# EAGLE design untitled (EAGLE 7.2.0)
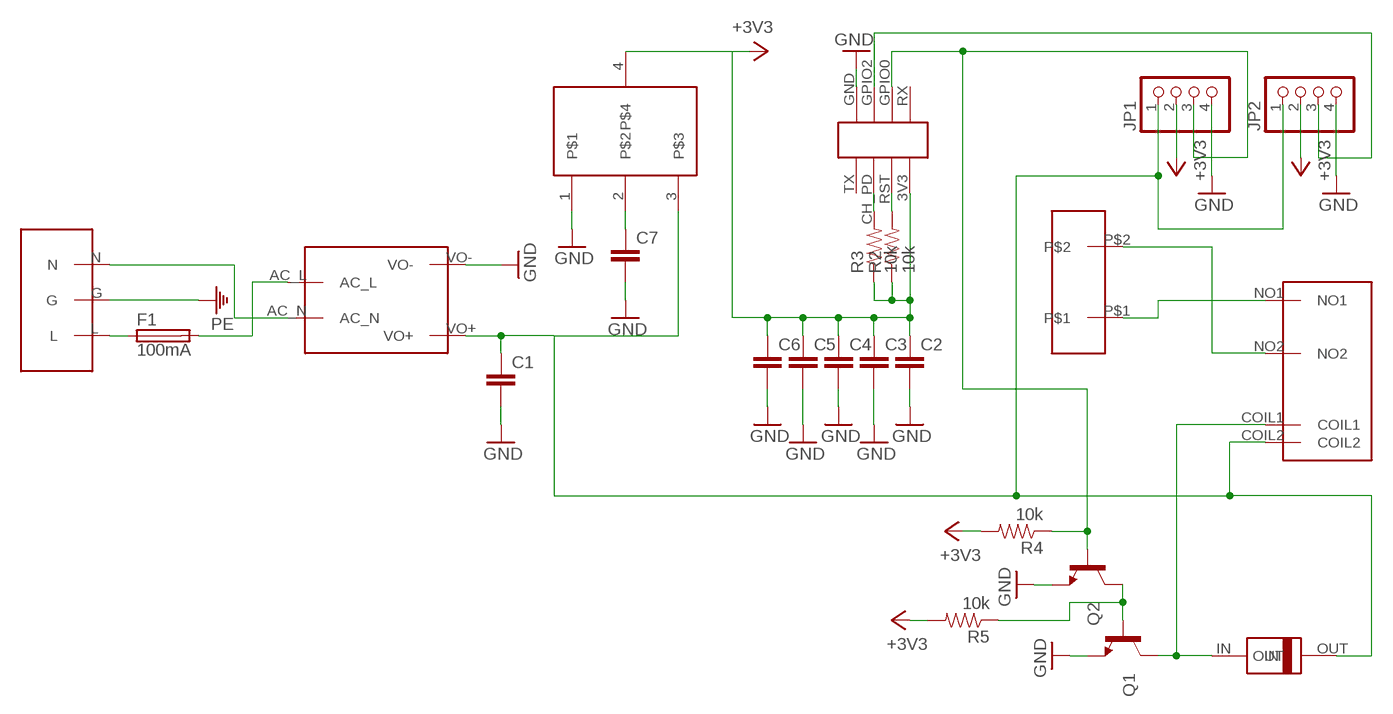
[diagram p0: schematic, sheet 1]

## Parts
C1  CAP0805  [0805]
C2  CAP0805  [0805]
C3  CAP0805  [0805]
C4  CAP0805  [0805]
C5  CAP0805  [0805]
C6  CAP0805  [0805]
C7  CAP0805  [0805]
DIODE1  DIODE_1N4148WQ-7-F  [DIODE_1N4148WQ-7-F]
F1  100mA  SH22,5A  [SH22,5A]
JP1  PINHD-1X4  [1X04]
JP2  PINHD-1X4  [1X04]
Q1  TRANSISTOR_NPNSOT23  [SOT23]
Q2  TRANSISTOR_NPNSOT23  [SOT23]
R2  10k  220-5%  [0603-RES]
R3  10k  220-5%  [0603-RES]
R4  10k  220-5%  [0603-RES]
R5  10k  220-5%  [0603-RES]
U$1  MAINS_CONVERTERS  [HLK-PM01]
U$2  SCREWTERMINALS_5MM  [3PIN_LNG]
U$4  VREG  [SOT223]
U$5  SCREWTERMINALS_5MM_2  [TERMINAL_2X]
U$6  OMRON_G6M-1A  [OMRON_G6M-1A]
U$7  ESP8266-01  [ESP8266-01]

## Nets
+3V3 [low voltage]: C2.1 C3.1 C4.1 C5.1 C6.1 JP1.2 JP2.2 R2.1 R3.1 R4.2 R5.2 U$4.4 U$7.3V3
GND [low voltage]: C1.2 C2.2 C3.2 C4.2 C5.2 C6.2 C7.2 JP1.4 JP2.4 Q1.2(E) Q2.2(E) U$1.VO- U$4.1 U$7.GND
N$1: F1.2 U$1.AC_L
N$2: U$1.AC_N U$2.N
N$3: F1.1 U$2.L
N$4 [low voltage]: C1.1 DIODE1.OUT JP1.1 JP2.1 U$1.VO+ U$4.3 U$6.COIL2
N$5 [low voltage]: Q1.1(B) Q2.3(C) R5.1
N$6: U$5.P$2 U$6.NO2
N$7: U$5.P$1 U$6.NO1
N$8 [low voltage]: DIODE1.IN Q1.3(C) U$6.COIL1
N$9 [low voltage]: JP2.3 U$7.GPIO2
N$11 [low voltage]: R2.2 U$7.RST
N$12 [low voltage]: C7.1 U$4.2
N$13 [low voltage]: JP1.3 Q2.1(B) R4.1 U$7.GPIO0
N$14 [low voltage]: R3.2 U$7.CH_PD
PE: U$2.G
Unconnected: U$7.RX U$7.TX

## Library data of the parts
C1-C7 = SparkFun-Capacitors:CAP: Capacitor Standard 0603 ceramic capacitor, and 0.1" leaded capacitor.
DIODE1 = captain-slow:DIODE_1N4148WQ-7-F
F1 = fuse:SH22,5A: FUSE HOLDER grid 22,5mm, isolated cap OGN0031 8201, Schurter (Buerklin); MPN: 0031.7701.11; OC_FARNELL: unknown; OC_NEWARK: 04F1224
JP1 JP2 = pinhead:PINHD-1X4: PIN HEADER
Q1 Q2 = SparkFun:TRANSISTOR_NPN: Transistor NPN BJT configuration in SOT23 package. MMBT2222 is the common NPN we use. Double check BCE configuration again layout.
R2-R5 = SparkFun-Resistors:220-5%: 220-ohm SMT 1/8W - 5% (0805) RES-07866; PROD_ID: RES-07866; VALUE: 220
U$1 = captain-slow:MAINS_CONVERTERS
U$2 = captain-slow:SCREWTERMINALS_5MM
U$4 = 4pi:VREG
U$5 = captain-slow:SCREWTERMINALS_5MM_2
U$6 = captain-slow:OMRON_G6M-1A
U$7 = captain-slow:ESP8266-01

## Net classes
0 mains: width 0.203 mm, clearance 1.25 mm
1 low voltage: width 0.203 mm, drill 0.127 mm, clearance 0.305 mm to class 0, clearance 0.305 mm

## Board
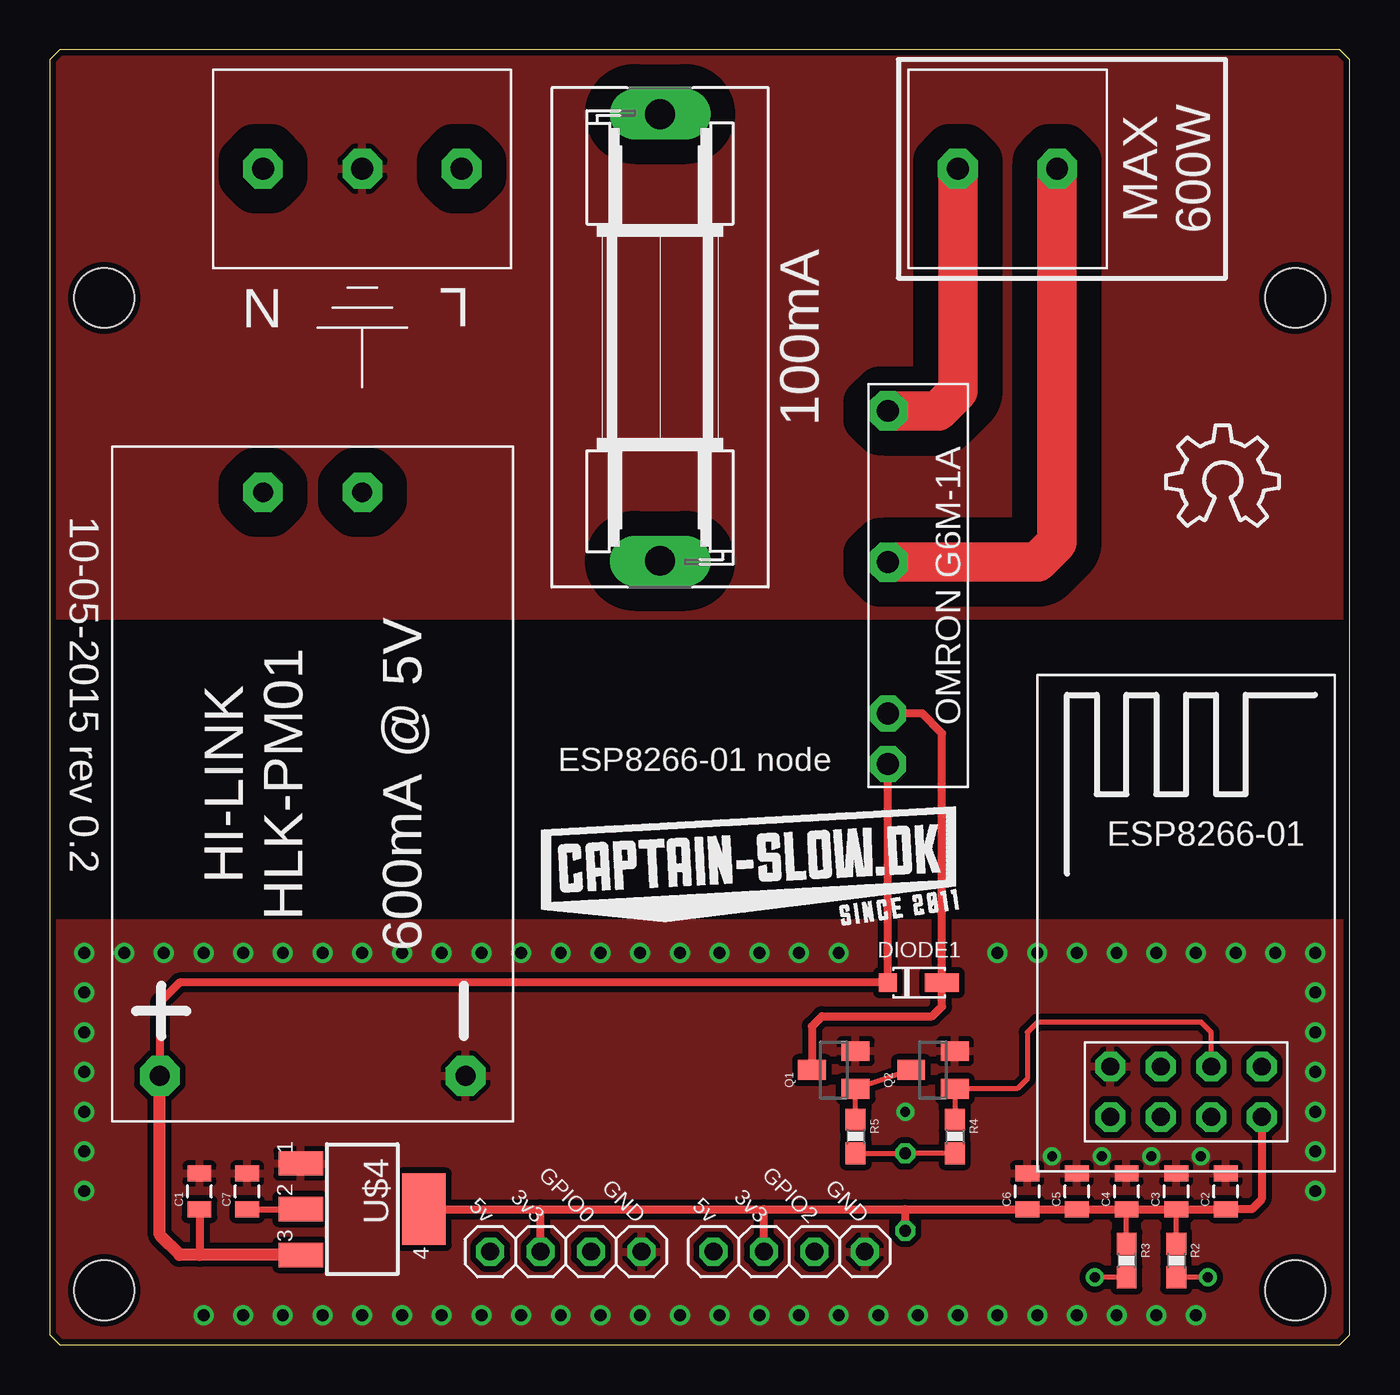
[diagram p1: board, top side]
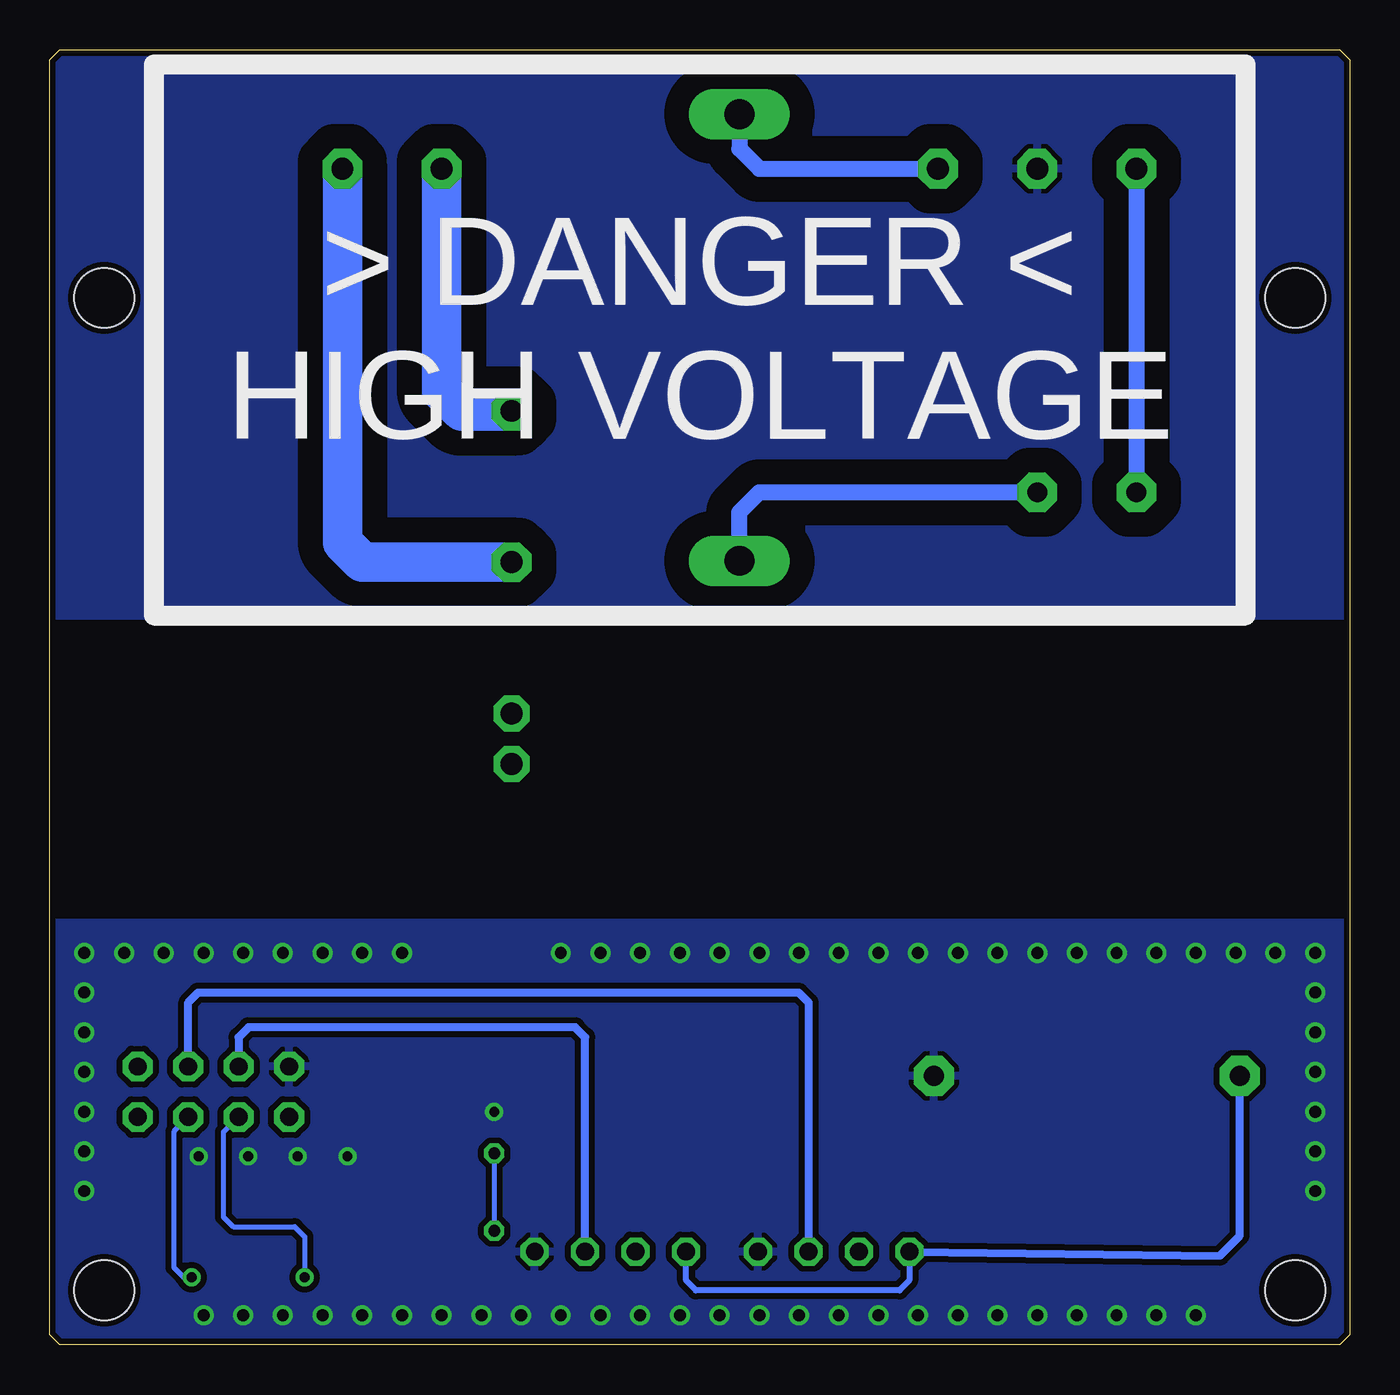
[diagram p2: board, bottom side, seen from below]

Size 65.5 x 65.25 mm. Coordinates in mm from the lower left corner, seen from the top.
Outline: 65,65.25 0.5,65.25 0,64.75 0,0.5 0.5,0 65,0 65.5,0.5 65.5,64.75 65,65.25
Copper layers (1*16): Top 0.035mm / dielectric 1.5mm / Bottom 0.035mm
Design rules "default *": minimum track width 10mil, minimum drill 24mil, track to track 8mil, track to pad 8mil, pad to pad 8mil, via to via 8mil, smd to smd 8mil, copper to edge 12mil, drill to drill 8mil, minimum pad ring 10mil, minimum via ring 8mil, stop-mask expansion 4mil, vias tented up to drill 0.7mm, thermal gap 10mil
Holes 3 mm at 2.75,2.75 62.75,2.75 2.75,52.75 62.75,52.75

### Footprints (pad centres in the part's own frame; a part is rotated, then mirrored left to right if it is on the bottom)
0805 = smd 0.8 x 1.2: 1 -0.9,0; 2 0.9,0
DIODE_1N4148WQ-7-F = smd 1.7 x 0.95: IN 1.15,0 | smd 0.9 x 0.95: OUT -1.575,0
SH22,5A = drill 1.5 pad 2.54 long: 1 -11.252,0; 2 11.252,0
1X04 = drill 0.9 octagon: 1 -3.81,0; 2 -1.27,0; 3 1.27,0; 4 3.81,0
SOT23 = smd 1 x 1.4: 1 -0.95,-1.1; 2 0.95,-1.1; 3 0,1.1
0603-RES = smd 1.1 x 1: 1 -0.85,0; 2 0.85,0
HLK-PM01 = drill 1 pad 2 octagon: AC_L -14.7,2.5; AC_N -14.7,-2.5; VO+ 14.7,-7.7; VO- 14.7,7.7
3PIN_LNG = drill 1.1 pad 2 octagon: G 0,0; L 0,-5; N 0,5
SOT223 = smd 1.219 x 2.235: 1 -2.311,-3.099; 2 0,-3.099; 3 2.311,-3.099 | smd 3.6 x 2.2: 4 0,3.099
TERMINAL_2X = drill 1.1 pad 2 octagon: P$1 0,2.5; P$2 0,-2.5
OMRON_G6M-1A = drill 1.1 pad 1.8 octagon: COIL1 -1.52,-6.44; COIL2 -1.52,-8.98 | drill 1.1 pad 2 octagon: NO1 -1.52,8.8; NO2 -1.52,1.18
ESP8266-01 = drill 0.9 pad 1.5 octagon: 3V3 -1.27,-3.81; CH_PD -1.27,1.27; GND 1.27,3.81; GPIO0 1.27,-1.27; GPIO2 1.27,1.27; RST -1.27,-1.27; RX 1.27,-3.81; TX -1.27,3.81

### Placement (x,y rotation side)
C1  7.55,7.74 90 top
C2  59.25,7.74 90 top
C3  56.75,7.74 90 top
C4  54.25,7.74 90 top
C5  51.75,7.74 90 top
C6  49.25,7.74 90 top
C7  9.95,7.74 90 top
DIODE1  43.8,18.25 0 top
F1  30.75,50.75 270 top
JP1  26,4.7 0 top
JP2  37.25,4.7 0 top
Q1  39.5,13.85 90 top
Q2  44.5,13.85 90 top
R2  56.75,4.25 270 top
R3  54.25,4.25 270 top
R4  45.6,10.5 270 top
R5  40.6,10.5 270 top
U$1  13.25,28.25 270 top
U$2  15.75,59.25 90 top
U$3  [OSHW_8X200_NOTEXT]  56.25,41.25 0 top
U$4  15.75,6.84 270 top
U$5  48.25,59.25 90 top
U$6  43.75,38.25 0 top
U$7  57.25,12.75 90 top
U$8  [CAPTAIN_SLOW_SMALL]  24.75,20.75 0 top

### Tracks (layer width: path | path; a pad name or v marks a point on that pad's centre or on a via)
+3V3  (via drill 0.6)
  Top 0.254: R4.2 v43.1,9.65 R5.2 | R2.1 C3.1 | R3.1 C4.1
  Top 0.406: U$4.4 24.73,6.84 | 24.73,6.84 35.98,6.84 | 35.98,6.84 43.1,6.84 | 43.1,6.84 C6.1 C5.1 C4.1 C3.1 C2.1 60.56,6.84 61.06,7.34 U$7.3V3 | JP1.2 24.73,6.84 | JP2.2 35.98,6.84 | v43.1,5.75 43.1,6.84
  Bottom 0.254: v43.1,9.65 v43.1,5.75
GND  (via drill 0.5, 0.6)
  other vias: 7.75,1.5 9.75,1.5 11.75,1.5 13.75,1.5 15.75,1.5 17.75,1.5 19.75,1.5 21.75,1.5 23.75,1.5 25.75,1.5 27.75,1.5 29.75,1.5 31.75,1.5 33.75,1.5 35.75,1.5 37.75,1.5 39.75,1.5 41.75,1.5 43.75,1.5 45.75,1.5 47.75,1.5 49.75,1.5 51.75,1.5 53.75,1.5 55.75,1.5 57.75,1.5 63.75,7.75 63.75,9.75 63.75,11.75 63.75,13.75 63.75,15.75 1.75,7.75 1.75,9.75 1.75,11.75 1.75,13.75 1.75,15.75 63.75,17.75 61.75,19.75 59.75,19.75 57.75,19.75 55.75,19.75 53.75,19.75 51.75,19.75 49.75,19.75 47.75,19.75 39.75,19.75 37.75,19.75 35.75,19.75 33.75,19.75 31.75,19.75 29.75,19.75 27.75,19.75 25.75,19.75 23.75,19.75 21.75,19.75 19.75,19.75 17.75,19.75 15.75,19.75 13.75,19.75 11.75,19.75 9.75,19.75 7.75,19.75 5.75,19.75 3.75,19.75 1.75,17.75 58,9.5 55.5,9.5 53,9.5 50.5,9.5 63.75,19.75 1.75,19.75 43.1,11.75
  pour Top: 0,-0.25 0,21.25 65.5,21.25 65.5,-0.25
  pour Bottom: -0.25,-0.5 -0.25,21.25 65.75,21.25 65.75,-0.5
N$1
  Bottom 0.813: F1.2 30.75,41.95 29.75,42.95 U$1.AC_L
N$2
  Bottom 0.813: U$2.N U$1.AC_N
N$3
  Bottom 0.813: F1.1 30.75,60.25 29.75,59.25 U$2.L
N$4
  Top 0.406: U$1.VO+ 5.55,17.25 6.55,18.25 DIODE1.OUT U$6.COIL2 | C1.1 7.55,4.53
  Top 0.61: U$4.3 7.55,4.53 6.55,4.53 5.55,5.53 U$1.VO+
  Bottom 0.305: JP1.1 22.19,3.25 22.69,2.75 32.94,2.75 33.44,3.25 JP2.1
  Bottom 0.406: JP1.1 6.55,4.5 5.55,5.5 U$1.VO+
N$5
  Top 0.254: Q2.3 Q1.1 R5.1
N$6
  Top 2: 42.25,39.43 49.75,39.43 50.75,40.43 U$5.P$2
  Bottom 2: U$6.NO2 49.75,39.43 50.75,40.43 U$5.P$2
N$7
  Top 2: 42.25,47.05 44.75,47.05 45.75,48.05 U$5.P$1
  Bottom 2: U$6.NO1 44.75,47.05 45.75,48.05 U$5.P$1
N$8
  Top 0.406: Q1.3 38.4,16.05 38.9,16.55 44.45,16.55 44.95,17.05 DIODE1.IN 44.95,30.81 43.95,31.81 U$6.COIL1
N$9
  Bottom 0.406: JP2.3 38.52,15.5 39.02,16 55.48,16 55.98,15.5 U$7.GPIO2
N$11  (via drill 0.5)
  Top 0.254: v58.35,3.4 R2.2
  Bottom 0.254: U$7.RST 59.25,10.75 59.25,3.9 58.75,3.4 v58.35,3.4
N$12
  Top 0.305: C7.1 U$4.2
N$13
  Top 0.254: U$7.GPIO0 58.52,15.75 58.02,16.25 49.75,16.25 49.25,15.75 49.25,13.4 48.75,12.9 Q2.1 R4.1
  Bottom 0.406: U$7.GPIO0 58.52,17.25 58.02,17.75 27.77,17.75 27.27,17.25 JP1.3
N$14  (via drill 0.5)
  Top 0.254: R3.2 v52.65,3.4
  Bottom 0.254: U$7.CH_PD 56.75,10.71 56.75,6.45 56.25,5.95 53.15,5.95 52.65,5.45 v52.65,3.4
PE
  pour Bottom: -0.75,36.75 -0.75,66.25 65.75,66.25 65.75,36.75
  pour Top: -1.75,67.25 -1.75,36.75 65.5,36.75 65.5,67.25

### Text on the board
tNames: MAX / 600W | 10-05-2015 rev 0.2 | ESP8266-01 node | 5v | 3v3 | GPIO0 | GND | 5v | 3v3 | GPIO2 | GND
bNames: > DANGER < / HIGH VOLTAGE